# EAGLE design 7segement4digits1badidea-mk-2.0 (EAGLE 6.5.0)
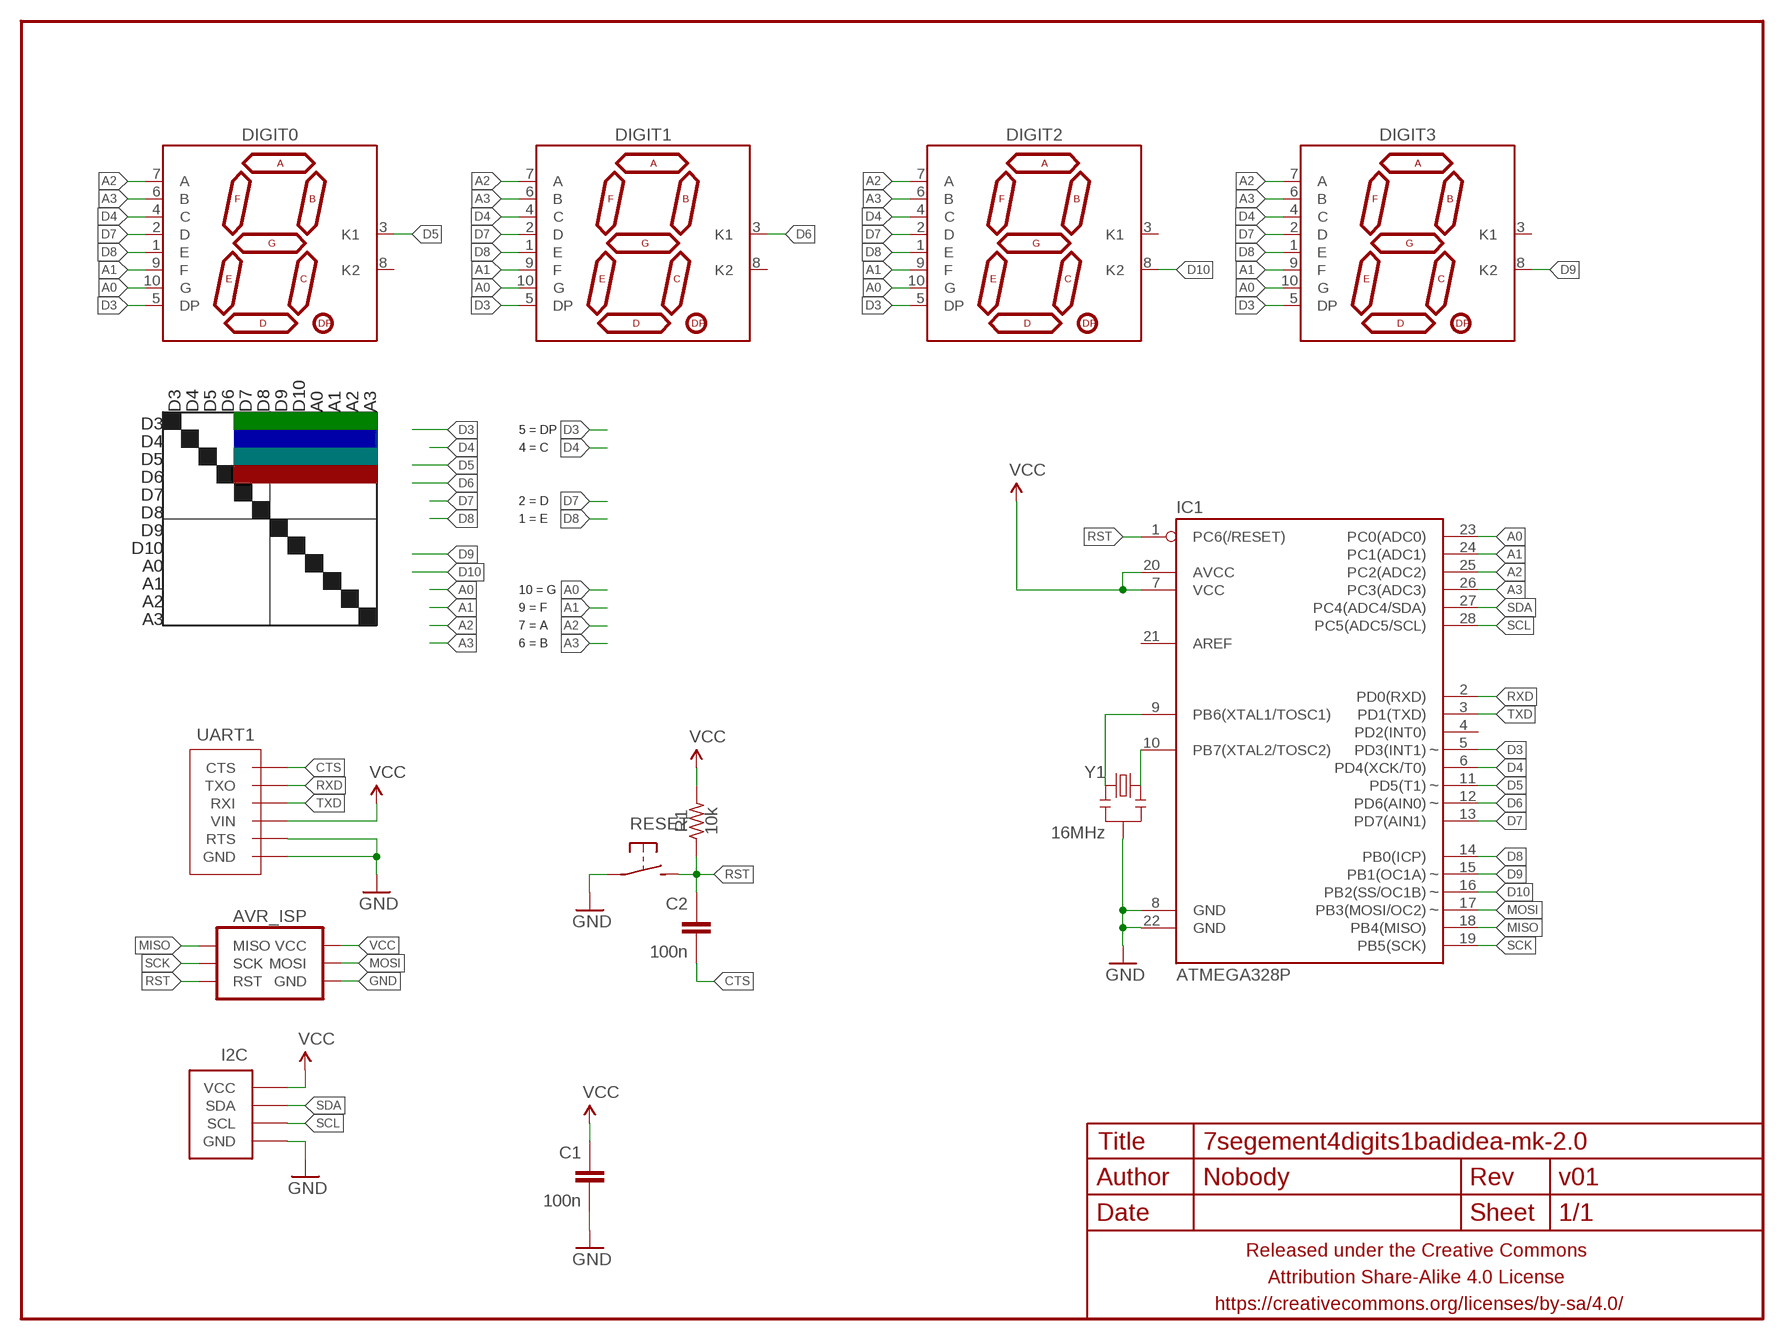
[diagram p0: schematic, sheet 1]

## Parts
AVR_ISP  AVR_SPI_PRG_6PTH  [2X3]
C1  100n  CAPACITOR-CERAMIC025-024X044  [C025-024X044]
C2  100n  CAPACITOR-CERAMIC025-024X044  [C025-024X044]
DIGIT0  7SEG_1DIGPTH-25.4MM  [7SEG_1DIG_25.4MM]
DIGIT1  7SEG_1DIGPTH-25.4MM  [7SEG_1DIG_25.4MM]
DIGIT2  7SEG_1DIGPTH-25.4MM  [7SEG_1DIG_25.4MM]
DIGIT3  7SEG_1DIGPTH-25.4MM  [7SEG_1DIG_25.4MM]
FRAME1  FRAME-LETTERNO_PACKAGE  [DUMMY]
I2C  M04-I2CPTH-0.1IN-CENTERED-FLIPPED  [1X04-PTH-VERT-I2C-CENTERED-FLIPPED]
IC1  ATMEGA328P  ATMEGA328P_PDIP  [DIL28-3]
R1  10k  RESISTORPTH-AXIAL-7.62MM  [RESISTOR-AXIAL-PTH-7.62MM]
RESET  SPST-NO-TACT3MM-PTH-SMALL-PADS  [DTS-3-SMALL-PADS]
UART1  M06-UARTPTH-0.1IN  [1X06_PTH_UART]
Y1  16MHz  RESONATORPTH  [RESONATOR-PTH]

## Nets
A0: DIGIT0.10(G) DIGIT1.10(G) DIGIT2.10(G) DIGIT3.10(G) IC1.23(PC0(ADC0))
A1: DIGIT0.9(F) DIGIT1.9(F) DIGIT2.9(F) DIGIT3.9(F) IC1.24(PC1(ADC1))
A2: DIGIT0.7(A) DIGIT1.7(A) DIGIT2.7(A) DIGIT3.7(A) IC1.25(PC2(ADC2))
A3: DIGIT0.6(B) DIGIT1.6(B) DIGIT2.6(B) DIGIT3.6(B) IC1.26(PC3(ADC3))
CTS: C2.2 UART1.CTS
D3: DIGIT0.5(DP) DIGIT1.5(DP) DIGIT2.5(DP) DIGIT3.5(DP) IC1.5(PD3(INT1))
D4: DIGIT0.4(C) DIGIT1.4(C) DIGIT2.4(C) DIGIT3.4(C) IC1.6(PD4(XCK/T0))
D5: DIGIT0.3(K1) IC1.11(PD5(T1))
D6: DIGIT1.3(K1) IC1.12(PD6(AIN0))
D7: DIGIT0.2(D) DIGIT1.2(D) DIGIT2.2(D) DIGIT3.2(D) IC1.13(PD7(AIN1))
D8: DIGIT0.1(E) DIGIT1.1(E) DIGIT2.1(E) DIGIT3.1(E) IC1.14(PB0(ICP))
D9: DIGIT3.8(K2) IC1.15(PB1(OC1A))
D10: DIGIT2.8(K2) IC1.16(PB2(SS/OC1B))
GND: AVR_ISP.6(GND) C1.2 I2C.GND IC1.8(GND) IC1.22(GND) RESET.1 UART1.GND UART1.RTS Y1.2
MISO: AVR_ISP.1(MISO) IC1.18(PB4(MISO))
MOSI: AVR_ISP.4(MOSI) IC1.17(PB3(MOSI/OC2))
N$1: IC1.10(PB7(XTAL2/TOSC2)) Y1.1
N$2: IC1.9(PB6(XTAL1/TOSC1)) Y1.3
RST: AVR_ISP.5(RST) C2.1 IC1.1(PC6(/RESET)) R1.P$1 RESET.2
RXD: IC1.2(PD0(RXD)) UART1.TXO
SCK: AVR_ISP.3(SCK) IC1.19(PB5(SCK))
SCL: I2C.SCL IC1.28(PC5(ADC5/SCL))
SDA: I2C.SDA IC1.27(PC4(ADC4/SDA))
TXD: IC1.3(PD1(TXD)) UART1.RXI
VCC: AVR_ISP.2(VCC) C1.1 I2C.VCC IC1.7(VCC) IC1.20(AVCC) R1.P$2 UART1.VCC(VIN)
Unconnected: DIGIT0.8(K2) DIGIT1.8(K2) DIGIT2.3(K1) DIGIT3.3(K1) IC1.4(PD2(INT0)) IC1.21(AREF)

## Notes on the sheet
- D3 | D4 | D5 | D6 | D7 | D8 | D9 | D10 | A0 | A1 | A2 | A3
- D3 | A | B | C | D | E | F | G | DP | 5 = DP
- D4 | 4 = C
- D5
- D6
- D7 | 2 = D
- D8 | 1 = E
- D9
- D10
- A0
- A1 | 10 = G
- A2 | 9 = F
- A3 | 7 = A
- 6 = B

## Library data of the parts
AVR_ISP = A_butts:AVR_SPI_PRG_6: AVR ISP 6 Pin This is the reduced ISP connector for AVR programming. Common on Arduino. This footprint will take up less PCB space and can be used with a 10-pin to 6-pin adapter such as SKU: BOB-08508 **Special note about "TEST_POINT" package. The stop mask is on the top side, so if you want your programming test points to be on the bottom of your board, make sure to place this package on the bottom side of the board. This also ensure that the orientation to program from the bottom side will be correct.
C1 C2 = A_butts:CAPACITOR-CERAMIC: CAPACITOR, European symbol
DIGIT0 DIGIT1-DIGIT3 = A_butts:7SEG_1DIG
FRAME1 = A_butts:FRAME-LETTER: Schematic Frame Standard 8.5x11 US Letter frame; DESIGNER: Nobody; VERSION: v01
I2C = A_butts:M04-I2C
IC1 = A_butts:ATMEGA328P_PDIP: uC used in the Arduino 32kb flash, 1k EEPROM, 2k SRAM This is the through-hole version of this chip.
R1 = A_butts:RESISTOR: RESISTOR, American symbol
RESET = A_butts:SPST-NO-TACT
UART1 = A_butts:M06-UART
Y1 = A_butts:RESONATOR: Resonator Small SMD resonator. Used, eg, on the Arduino Pro/ Pro Mini boards. 8MHz- XTAL-08895 16MHz- XTAL-08900

## Board
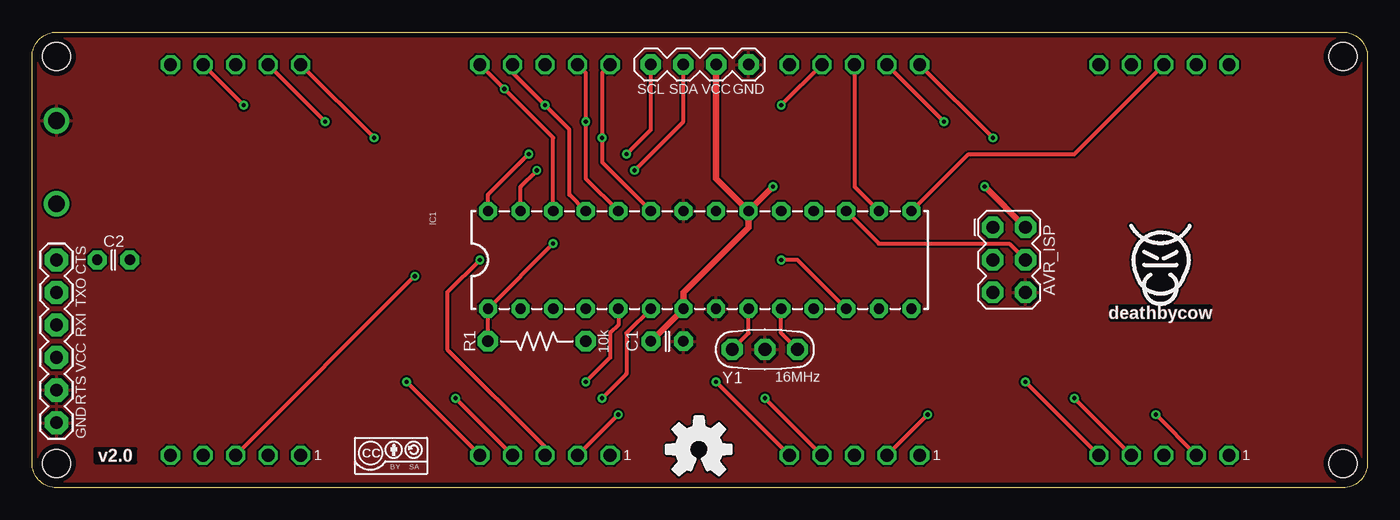
[diagram p1: board, top side]
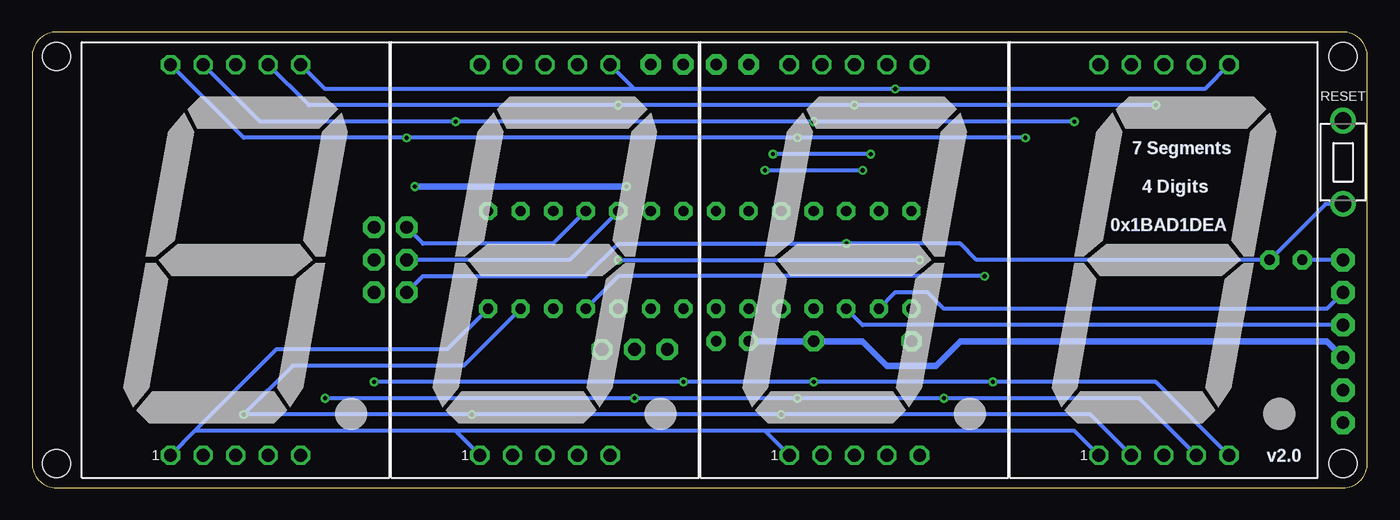
[diagram p2: board, bottom side, seen from below]

Size 104.14 x 35.56 mm. Coordinates in mm from the lower left corner, seen from the top.
Outline: 1.91,35.56 102.23,35.56 arc-90 104.14,33.66 104.14,1.91 arc-90 102.23,0 1.91,0 arc-90 0,1.91 0,33.66 arc-90 1.91,35.56
Copper layers (1*16): Top 0.0356mm / dielectric 1.5011mm / Bottom 0.0356mm
Design rules "LaenPCBOrder2": minimum track width 6mil, minimum drill 13mil, track to track 6mil, track to pad 6mil, pad to pad 6mil, via to via 6mil, smd to smd 6mil, copper to edge 15mil, drill to drill 6mil, minimum pad ring 7mil, minimum via ring 7mil, stop-mask expansion 3mil, vias tented up to drill 20mil, thermal gap 10mil
Holes 2.2 mm at 1.91,33.66 1.91,1.91 102.23,1.91 102.23,33.66

### Footprints (pad centres in the part's own frame; a part is rotated, then mirrored left to right if it is on the bottom)
2X3 = drill 1 pad 1.676 octagon: 1 -2.54,-1.27; 2 -2.54,1.27; 3 0,-1.27; 4 0,1.27; 5 2.54,-1.27; 6 2.54,1.27
C025-024X044 = drill 0.813 pad 1.5 octagon: 1 -1.27,0; 2 1.27,0
7SEG_1DIG_25.4MM = drill 1 pad 1.5 octagon: 1 -5.08,-15.24; 2 -2.54,-15.24; 3 0,-15.24; 4 2.54,-15.24; 5 5.08,-15.24; 6 5.08,15.24; 7 2.54,15.24; 8 0,15.24; 9 -2.54,15.24; 10 -5.08,15.24
1X04-PTH-VERT-I2C-CENTERED-FLIPPED = drill 0.9 pad 1.6 octagon: GND 3.81,0; SCL -3.81,0; SDA -1.27,0; VCC 1.27,0
DIL28-3 = drill 0.8 pad 1.422 octagon: 1 -16.51,-3.81; 2 -13.97,-3.81; 3 -11.43,-3.81; 4 -8.89,-3.81; 5 -6.35,-3.81; 6 -3.81,-3.81; 7 -1.27,-3.81; 8 1.27,-3.81; 9 3.81,-3.81; 10 6.35,-3.81; 11 8.89,-3.81; 12 11.43,-3.81; 13 13.97,-3.81; 14 16.51,-3.81; 15 16.51,3.81; 16 13.97,3.81; 17 11.43,3.81; 18 8.89,3.81; 19 6.35,3.81; 20 3.81,3.81; 21 1.27,3.81; 22 -1.27,3.81; 23 -3.81,3.81; 24 -6.35,3.81; 25 -8.89,3.81; 26 -11.43,3.81; 27 -13.97,3.81; 28 -16.51,3.81
RESISTOR-AXIAL-PTH-7.62MM = drill 0.9 pad 1.6 octagon: P$1 -3.81,0; P$2 3.81,0
DTS-3-SMALL-PADS = drill 1.3 pad 2: 1 -3.25,0; 2 3.25,0
1X06_PTH_UART = drill 1 pad 1.8 octagon: CTS 12.7,0; GND 0,0; RTS 2.54,0; RXI 7.62,0; TXO 10.16,0; VCC 5.08,0
RESONATOR-PTH = drill 1 pad 1.65 octagon: 1 -2.54,0; 2 0,0; 3 2.54,0

### Placement (x,y rotation side)
AVR_ISP  76.2,17.78 270 top
C1  49.53,11.43 0 top
C2  6.35,17.78 180 top
DIGIT0  15.88,17.78 0 bottom
DIGIT1  40.01,17.78 0 bottom
DIGIT2  64.14,17.78 0 bottom
DIGIT3  88.27,17.78 0 bottom
FRAME1  0,0 0 top
I2C  52.07,33.02 0 top
IC1  52.07,17.78 0 top
R1  39.37,11.43 0 top
RESET  1.91,25.4 270 bottom
U$1  [CC-BY-SA-4.0-NO-URL]  28,2.5 0 top
U$2  [COW_SMALL_METAL]  88,17.9 0 top
U$3  [OSHWLOGO_TOP_0.2_A]  52,3 0 top
UART1  1.91,5.08 90 top
Y1  57.15,10.79 180 top

### Tracks (layer width: path | path; a pad name or v marks a point on that pad's centre or on a via)
A0  (via drill 0.33)
  Top 0.305: DIGIT0.10 v26.67,27.3 | DIGIT1.10 44.45,32.38 v44.45,27.3 44.45,25.4 IC1.23 | DIGIT2.10 v74.93,27.3
  Bottom 0.305: v26.67,27.3 v44.45,27.3 v74.93,27.3 87.63,27.3 DIGIT3.10
A1  (via drill 0.33)
  Top 0.305: DIGIT0.9 v22.86,28.57 | DIGIT1.9 43.18,32.38 v43.18,28.57 43.18,24.13 IC1.24 | DIGIT2.9 v71.12,28.57
  Bottom 0.305: v22.86,28.57 v43.18,28.57 v71.12,28.57 86.36,28.57 DIGIT3.9
A2  (via drill 0.33)
  Top 0.305: DIGIT0.7 v16.51,29.84 | IC1.25 41.91,22.86 41.91,27.94 v40.01,29.84 37.47,32.38 DIGIT1.7 | DIGIT2.7 v58.42,29.84
  Bottom 0.305: v16.51,29.84 v40.01,29.84 v58.42,29.84 82.55,29.84 DIGIT3.7
A3  (via drill 0.33)
  Top 0.305: IC1.26 40.64,27.3 v36.83,31.11 DIGIT1.6
  Bottom 0.305: DIGIT0.6 12.7,31.11 v36.83,31.11 57.15,31.11 | 57.15,31.11 81.28,31.11 DIGIT3.6 | DIGIT2.6 57.15,31.11
CTS
  Bottom 0.305: UART1.CTS C2.2
D3  (via drill 0.33)
  Top 0.305: v77.47,8.26 DIGIT3.5 | IC1.5 45.72,12.7 45.09,12.06 45.09,10.16 v43.18,8.26 | DIGIT2.5 v53.34,8.26 | DIGIT1.5 v29.21,8.26
  Bottom 0.305: DIGIT0.5 16.51,8.26 v29.21,8.26 v43.18,8.26 v53.34,8.26 v77.47,8.26
D4  (via drill 0.33)
  Top 0.305: v81.28,6.99 DIGIT3.4 | IC1.6 46.35,12.06 46.35,8.89 v44.45,6.99 | DIGIT2.4 v57.15,6.99 | DIGIT1.4 v33.02,6.99
  Bottom 0.305: DIGIT0.4 17.78,6.99 v33.02,6.99 v44.45,6.99 v57.15,6.99 v81.28,6.99
D5  (via drill 0.33)
  Top 0.305: DIGIT0.3 v29.84,16.51
  Bottom 0.305: v29.84,16.51 58.42,16.51 IC1.11
D6  (via drill 0.33)
  Top 0.305: IC1.12 59.69,17.78 v58.42,17.78 | v34.92,17.78 32.38,15.24 32.38,10.79 40.01,3.17 DIGIT1.3
  Bottom 0.305: v58.42,17.78 v34.92,17.78
D7  (via drill 0.33)
  Top 0.305: v87.63,5.71 DIGIT3.2 | DIGIT2.2 v69.85,5.71 | DIGIT1.2 v45.72,5.71
  Bottom 0.305: DIGIT0.2 21.59,5.71 v45.72,5.71 v69.85,5.71 v87.63,5.71 83.82,9.53 70.48,9.53 IC1.13
D8
  Bottom 0.305: DIGIT0.1 22.86,4.45 46.99,4.45 | 46.99,4.45 71.12,4.45 | 71.12,4.45 91.44,4.45 | 91.44,4.45 DIGIT3.1 | IC1.14 71.75,10.79 85.09,10.79 91.44,4.45 | DIGIT2.1 71.12,4.45 | DIGIT1.1 46.99,4.45
D9
  Top 0.305: IC1.15 73.03,26.04 81.28,26.04 DIGIT3.8
D10
  Top 0.305: DIGIT2.8 64.14,23.5 IC1.16
GND
  pour Top: 1.91,35.56 102.23,35.56 arc-90 104.14,33.66 104.14,1.91 arc-90 102.23,0 1.91,0 arc-90 0,1.91 0,33.66 arc-90
MISO
  Bottom 0.305: IC1.18 63.5,19.05 73.66,19.05 AVR_ISP.1
MOSI
  Top 0.305: IC1.17 66.04,19.05 76.2,19.05 AVR_ISP.4
N$1
  Top 0.305: Y1.1 58.42,12.06 IC1.10
N$2
  Top 0.305: Y1.3 55.88,12.06 IC1.9
RST  (via drill 0.33)
  Top 0.305: R1.P$1 IC1.1 v40.64,19.05
  Bottom 0.305: AVR_ISP.5 73.66,16.51 60.96,16.51 58.42,19.05 v40.64,19.05 31.75,19.05 30.48,17.78 C2.1 3.25,22.15 RESET.2
RXD
  Bottom 0.305: UART1.TXO 3.17,13.97 33.02,13.97 34.29,15.24 36.83,15.24 IC1.2
SCK
  Bottom 0.305: IC1.19 62.23,17.78 AVR_ISP.3
SCL  (via drill 0.33)
  Top 0.305: IC1.28 35.56,22.86 v38.73,26.04 | v46.35,26.04 48.26,27.94 I2C.SCL
  Bottom 0.305: v38.73,26.04 v46.35,26.04
SDA  (via drill 0.33)
  Top 0.305: IC1.27 38.1,23.5 v39.37,24.77 | v46.99,24.77 50.8,28.57 I2C.SDA
  Bottom 0.305: v39.37,24.77 v46.99,24.77
TXD
  Bottom 0.305: UART1.RXI 39.37,12.7 IC1.3
VCC  (via drill 0.33)
  Top 0.508: I2C.VCC 53.34,24.13 IC1.20 | IC1.20 55.88,20.32 50.8,15.24 IC1.7 C1.1 | AVR_ISP.2 v74.3,23.5 | v57.78,23.5 IC1.20
  Bottom 0.508: C1.1 R1.P$2 39.37,11.43 37.47,9.53 33.66,9.53 31.75,11.43 3.17,11.43 UART1.VCC | v74.3,23.5 v57.78,23.5

### Text on the board
Bottom: 7 Segments | 4 Digits | 0x1BAD1DEA
bPlace: 7 Segments | 4 Digits | 0x1BAD1DEA